# EAGLE schematic GlowStarter (EAGLE 7.7.0)
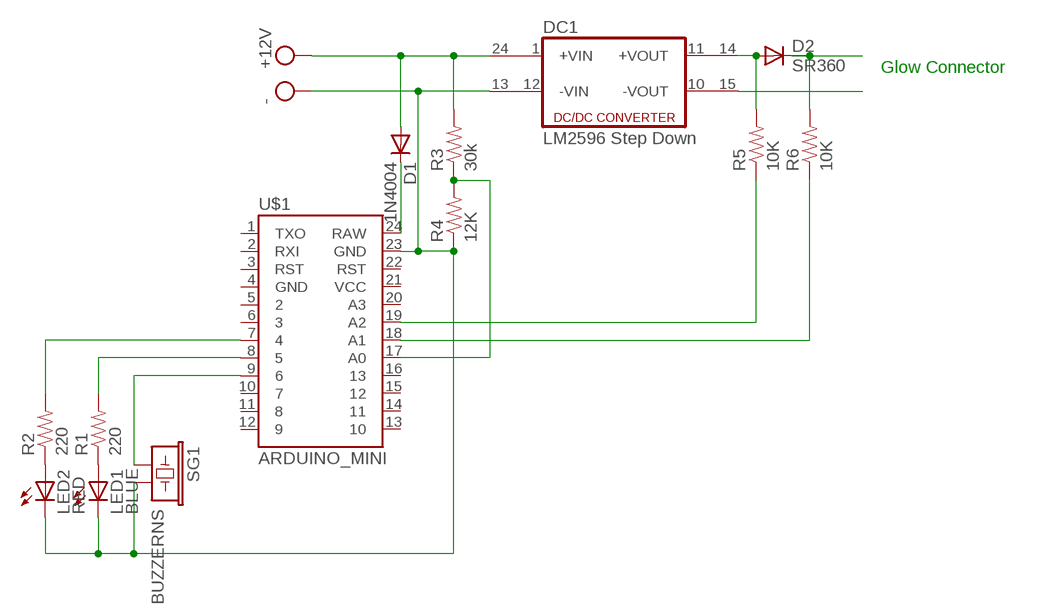
[diagram p0: schematic, sheet 1]

## Parts
D1  1N4004  [DO41-10]
D2  SR360  SB320  [DO201-15]
DC1  LM2596 Step Down  DC213R  [CMK]
LED1  BLUE  LED_ELD260  [LED_LD260]
LED2  RED  LED_ELD260  [LED_LD260]
R1  220  RESISTORKIT  [AXIAL-0.3-KIT]
R2  220  RESISTORKIT  [AXIAL-0.3-KIT]
R3  30k  RESISTORKIT  [AXIAL-0.3-KIT]
R4  12K  RESISTORKIT  [AXIAL-0.3-KIT]
R5  10K  RESISTORKIT  [AXIAL-0.3-KIT]
R6  10K  RESISTORKIT  [AXIAL-0.3-KIT]
SG1  BUZZERNS  [BUZZER-12MM-NS]
U$1  ARDUINO_MINI  [ARDUINO_MINI]

## Nets
N$1: LED1.A R1.P$1
N$2: LED2.A R2.P$1
N$3: R3.P$1 R4.P$2 U$1.17(A0)
N$4: D1.C U$1.24(RAW)
N$5: D2.A DC1.14(+VOUT1) R5.P$2
N$6: D2.C R6.P$2
N$7: DC1.15(-VOUT1)
N$8: R6.P$1 U$1.18(A1)
N$9: R5.P$1 U$1.19(A2)
N$10: SG1.+ U$1.9
N$11: R1.P$2 U$1.8
N$12: R2.P$2 U$1.7
VCC: D1.A DC1.13(-VIN1) DC1.24(+VIN1) LED1.K(C) LED2.K(C) R3.P$2 R4.P$1 SG1.- U$1.23(GND) ; supply symbol labelled -, +12V
Unconnected: DC1.1(+VIN) DC1.10(-VOUT) DC1.11(+VOUT) DC1.12(-VIN) U$1.1(TXO) U$1.2(RXI) U$1.3(RST) U$1.4(GND) U$1.5 U$1.6 U$1.10 U$1.11 U$1.12 U$1.13 U$1.14 U$1.15 U$1.16 U$1.20(A3) U$1.21(VCC) U$1.22(RST)

## Notes on the sheet
- Glow Connector

## Library data of the parts
D1 = diode:1N4004: DIODE general purpose rectifier, 1 A
D2 = diode:SB320: DIODE barrier rectifier, 3 A (Fairchild)
DC1 = dc-dc-converter:DC213R: DC-DC CONVERTER; OC_FARNELL: unknown; OC_NEWARK: unknown
LED1 LED2 = eagle-ltspice:LED_E: LED Source: http://www.osram.convergy.de Source: www.luxeon.com Source: www.kingbright.com; SPICEMODEL: NONE; SPICEPREFIX: D; SPICETYPE: diode
R1-R6 = SparkFun-Passives:RESISTOR: Resistor Basic schematic elements and footprints for 0603, 1206, and PTH resistors.
SG1 = SparkFun-Electromechanical:BUZZER: Buzzer 12mm Spark Fun Electronics SKU : Comp-Buzzer
U$1 = SparkFun-Boards:ARDUINO_MINI: Arduino Pro Mini footprint